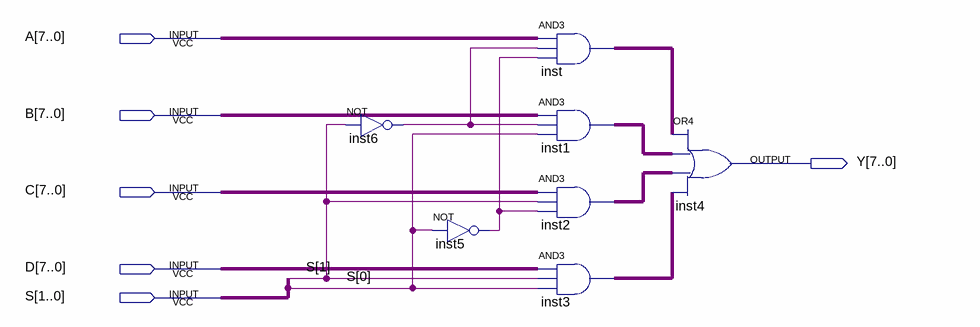
[diagram p0: schematic sheet]
// Quartus schematic 8mux41.bdf as structural Verilog: 7 symbols, 6 pins
module \8mux41  (
  input  [7:0] A,
  input  [7:0] B,
  input  [7:0] C,
  input  [7:0] D,
  input  [1:0] S,
  output [7:0] Y
);

  wire inst5_out, inst6_out;
  wire [7:0] inst1_out, inst2_out, inst3_out, inst_out;

  not inst6 (inst6_out, S[1]);
  not inst5 (inst5_out, S[0]);
  assign inst_out = A & {8{inst6_out}} & {8{inst5_out}};  // AND3 inst, 8 bits wide
  assign inst1_out = B & {8{inst6_out}} & {8{S[0]}};  // AND3 inst1, 8 bits wide
  assign inst2_out = C & {8{S[1]}} & {8{inst5_out}};  // AND3 inst2, 8 bits wide
  assign inst3_out = D & {8{S[1]}} & {8{S[0]}};  // AND3 inst3, 8 bits wide
  assign Y = inst_out | inst1_out | inst2_out | inst3_out;  // OR4 inst4, 8 bits wide
endmodule
